# EAGLE design SupportMachineTest (EAGLE 9.6.2)
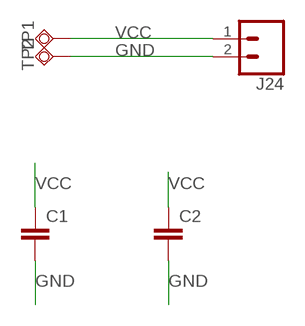
[diagram p0: schematic, sheet 1]

## Parts
C1  CAP-1206  [1206]
C2  CAP0805  [0805]
J24  CONN_02  [1X02]
TP1  TESTPAD_TPSQTP20SQ  [TESTPAD_TP20SQ]
TP2  TESTPAD_TPSQTP20SQ  [TESTPAD_TP20SQ]

## Nets
GND: C1.2 C2.2 J24.2 TP2.TP
VCC: C1.1 C2.1 J24.1 TP1.TP

## Library data of the parts
C1 = SparkFun-Capacitors:CAP
C2 = SparkFun-Passives:CAP: Capacitor Standard 0603 ceramic capacitor, and 0.1" leaded capacitor.
J24 = SparkFun-Connectors:CONN_02: Multi connection point. Often used as Generic Header-pin footprint for 0.1 inch spaced/style header connections On any of the 0.1 inch spaced packages, you can populate with these: Break Away Headers - Straight <https://www.sparkfun.com/products/116> (PRT-00116) Break Away Male Headers - Right Angle <https://www.sparkfun.com/products/553> (PRT-00553) Female Headers <https://www.sparkfun.com/products/115> (PRT-00115) Break Away Headers - Machine Pin <https://www.sparkfun.com/products/117> (PRT-00117) Break Away Female Headers - Swiss Machine Pin <https://www.sparkfun.com/products/743> (PRT-00743) For SCREWTERMINALS and SPRING TERMINALS visit here: Screw Terimnals on SparkFun.com <https://www.sparkfun.com/search/results?term=Screw+Terminals> (5mm/3.5mm/2.54mm spacing) This device is also useful as a general connection point to wire up your design to another part of your project. Our various solder wires solder well into these plated through hole pads. Hook-Up Wire - Assortment (Stranded, 22 AWG) <https://www.sparkfun.com/products/11375> (PRT-11375) Hook-Up Wire - Assortment (Solid Core, 22 AWG) <https://www.sparkfun.com/products/11367> (PRT-11367) View the entire wire category on our website here <https://www.sparkfun.com/categories/141> Special notes: Molex polarized connector foot print use with: PRT-08233 with associated crimp pins and housings. 2.54_SCREWTERM for use with PRT-10571. 3.5mm Screw Terminal footprints for PRT-08084 5mm Screw Terminal footprints for use with PRT-08432
TP1 TP2 = BeagleBone_Blue_R3:TESTPAD_TPSQ: Test pad

## Board
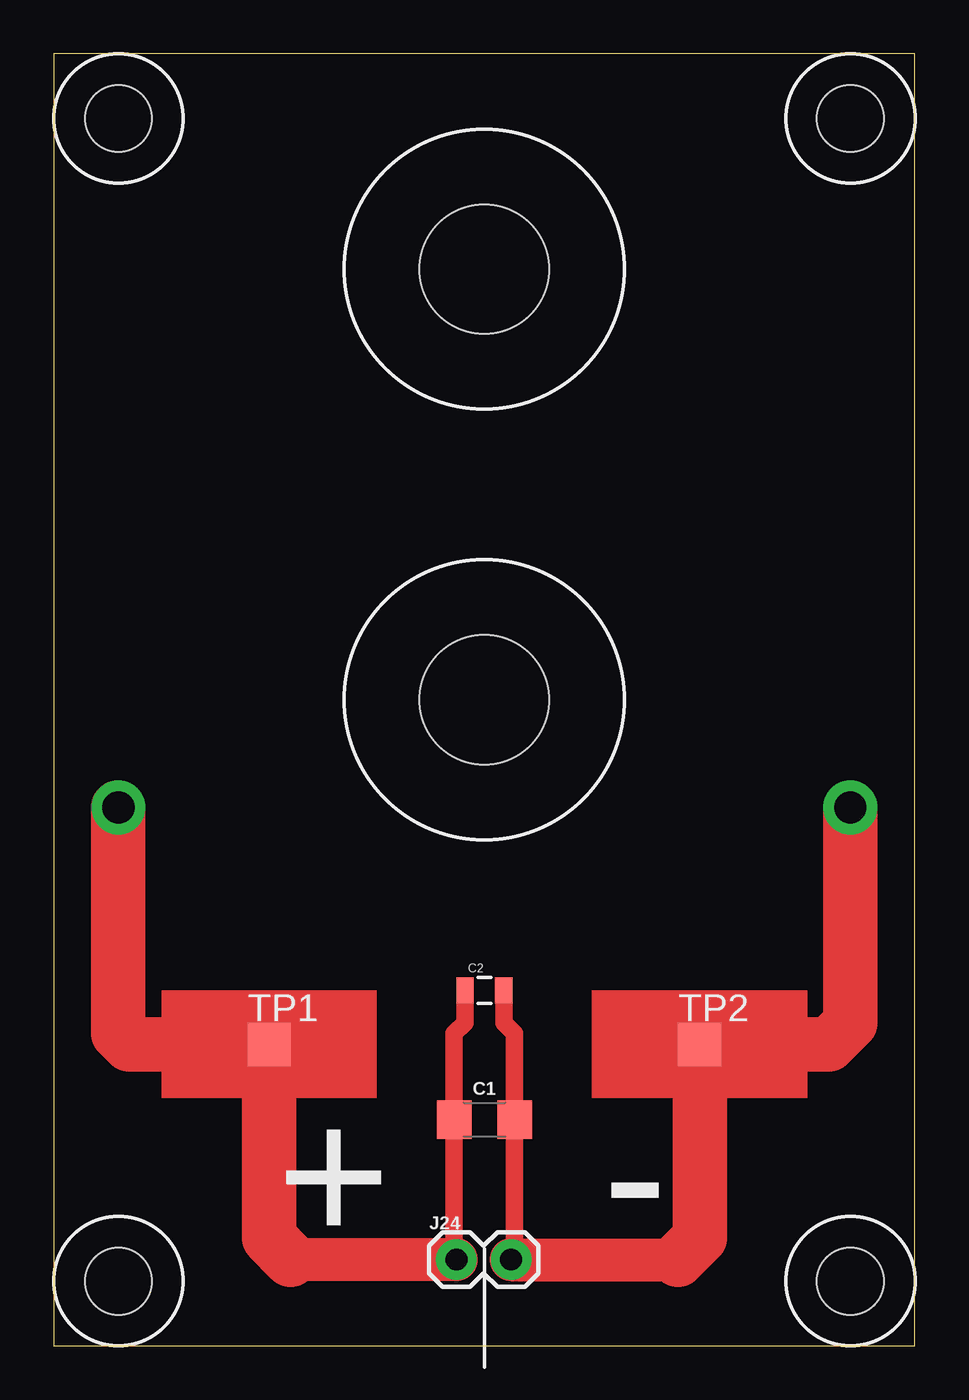
[diagram p1: board, top side]

Size 40 x 60 mm. Coordinates in mm from the lower left corner, seen from the top.
Outline: 0,0 40,0 40,60 0,60 0,0
Copper layers (1*16): Top 0.035mm / dielectric 1.5mm / Bottom 0.035mm
Design rules "default": minimum track width 6mil, minimum drill 0.35mm, track to track 6mil, track to pad 6mil, pad to pad 6mil, via to via 6mil, smd to smd 6mil, copper to edge 40mil, drill to drill 6mil, minimum pad ring 10mil, minimum via ring 8mil, stop-mask expansion 4mil, vias tented up to drill 0mil, thermal gap 10mil
Holes 3.1 mm at 3,57 37,57 37,3 3,3
Holes 6 mm at 20,50 20,30

### Footprints (pad centres in the part's own frame; a part is rotated, then mirrored left to right if it is on the bottom)
1206 = smd 1.6 x 1.8: 1 -1.4,0; 2 1.4,0
0805 = smd 0.8 x 1.2: 1 -0.9,0; 2 0.9,0
1X02 = drill 1.016 pad 1.88: 1 0,0; 2 2.54,0
TESTPAD_TP20SQ = smd 2 x 2: TP 0,0

### Placement (x,y rotation side)
C1  20,10.5 0 top
C2  20,16.5 0 top
J24  18.7,4 0 top
TP1  10,14 0 top
TP2  30,14 0 top

### Tracks (layer width: path | path; a pad name or v marks a point on that pad's centre or on a via)
GND  (via drill 1.5 pad 2.5)
  Top 0.813: C2.2 20.9,15 21.4,14.5 C1.2 21.4,4.16 J24.2
  Top 2: J24.2 29,4
  Top 2.54: 29,4 30,5 TP2.TP 36,14 37,15 v37,25
VCC  (via drill 1.5 pad 2.5)
  Top 0.813: J24.1 18.6,4.1 C1.1 18.6,14.5 19.1,15 C2.1
  Top 2: J24.1 11,4
  Top 2.54: 11,4 10,5 TP1.TP 3.5,14 3,14.5 v3,25
(copper drawn outside any net)
  shapes: Top area x2

### Text on the board
tPlace: + | -